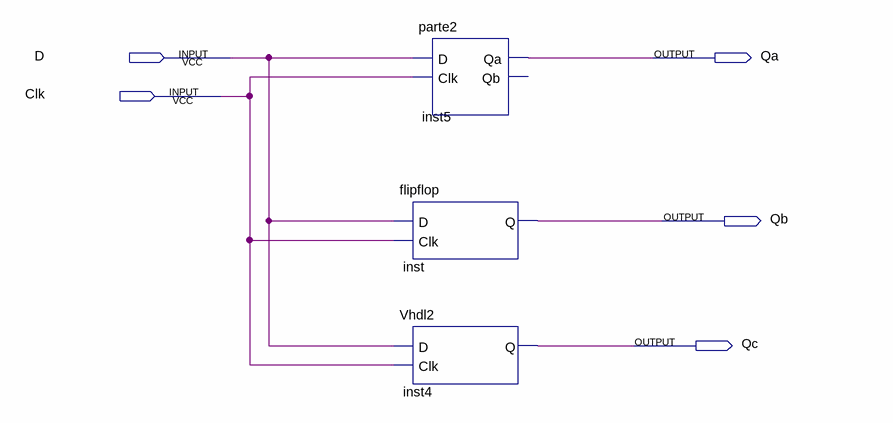
[diagram p0: schematic sheet]
// Quartus schematic flipflop_2.bdf as structural Verilog: 3 symbols, 5 pins
module flipflop_2 (
  input  D,
  input  Clk,
  output Qa,
  output Qb,
  output Qc
);

  flipflop inst (.D(D), .Clk(Clk), .Q(Qb));
  Vhdl2 inst4 (.D(D), .Clk(Clk), .Q(Qc));
  parte2 inst5 (.D(D), .Clk(Clk), .Qa(Qa));  // open: Qb
endmodule
